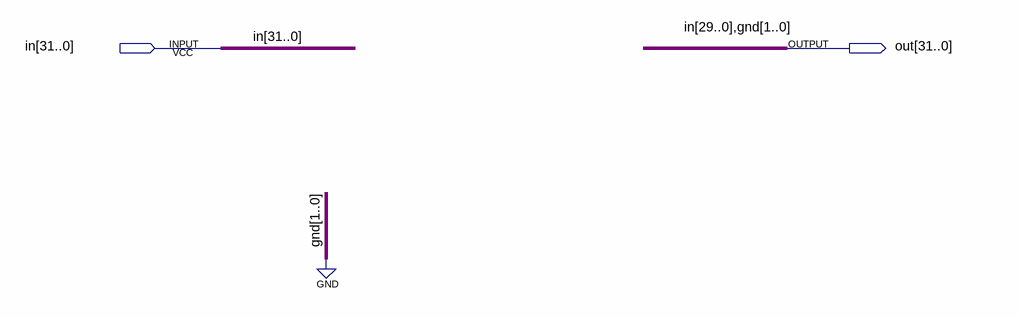
[diagram p0: schematic sheet]
// Quartus schematic sll2.bdf as structural Verilog: 0 symbols, 2 pins
module sll2 (
  input  [31:0] in,
  output [31:0] out
);


  assign out = {in[29:0], 2'b00};
endmodule
